# EAGLE schematic BSPD (EAGLE 9.3.0)
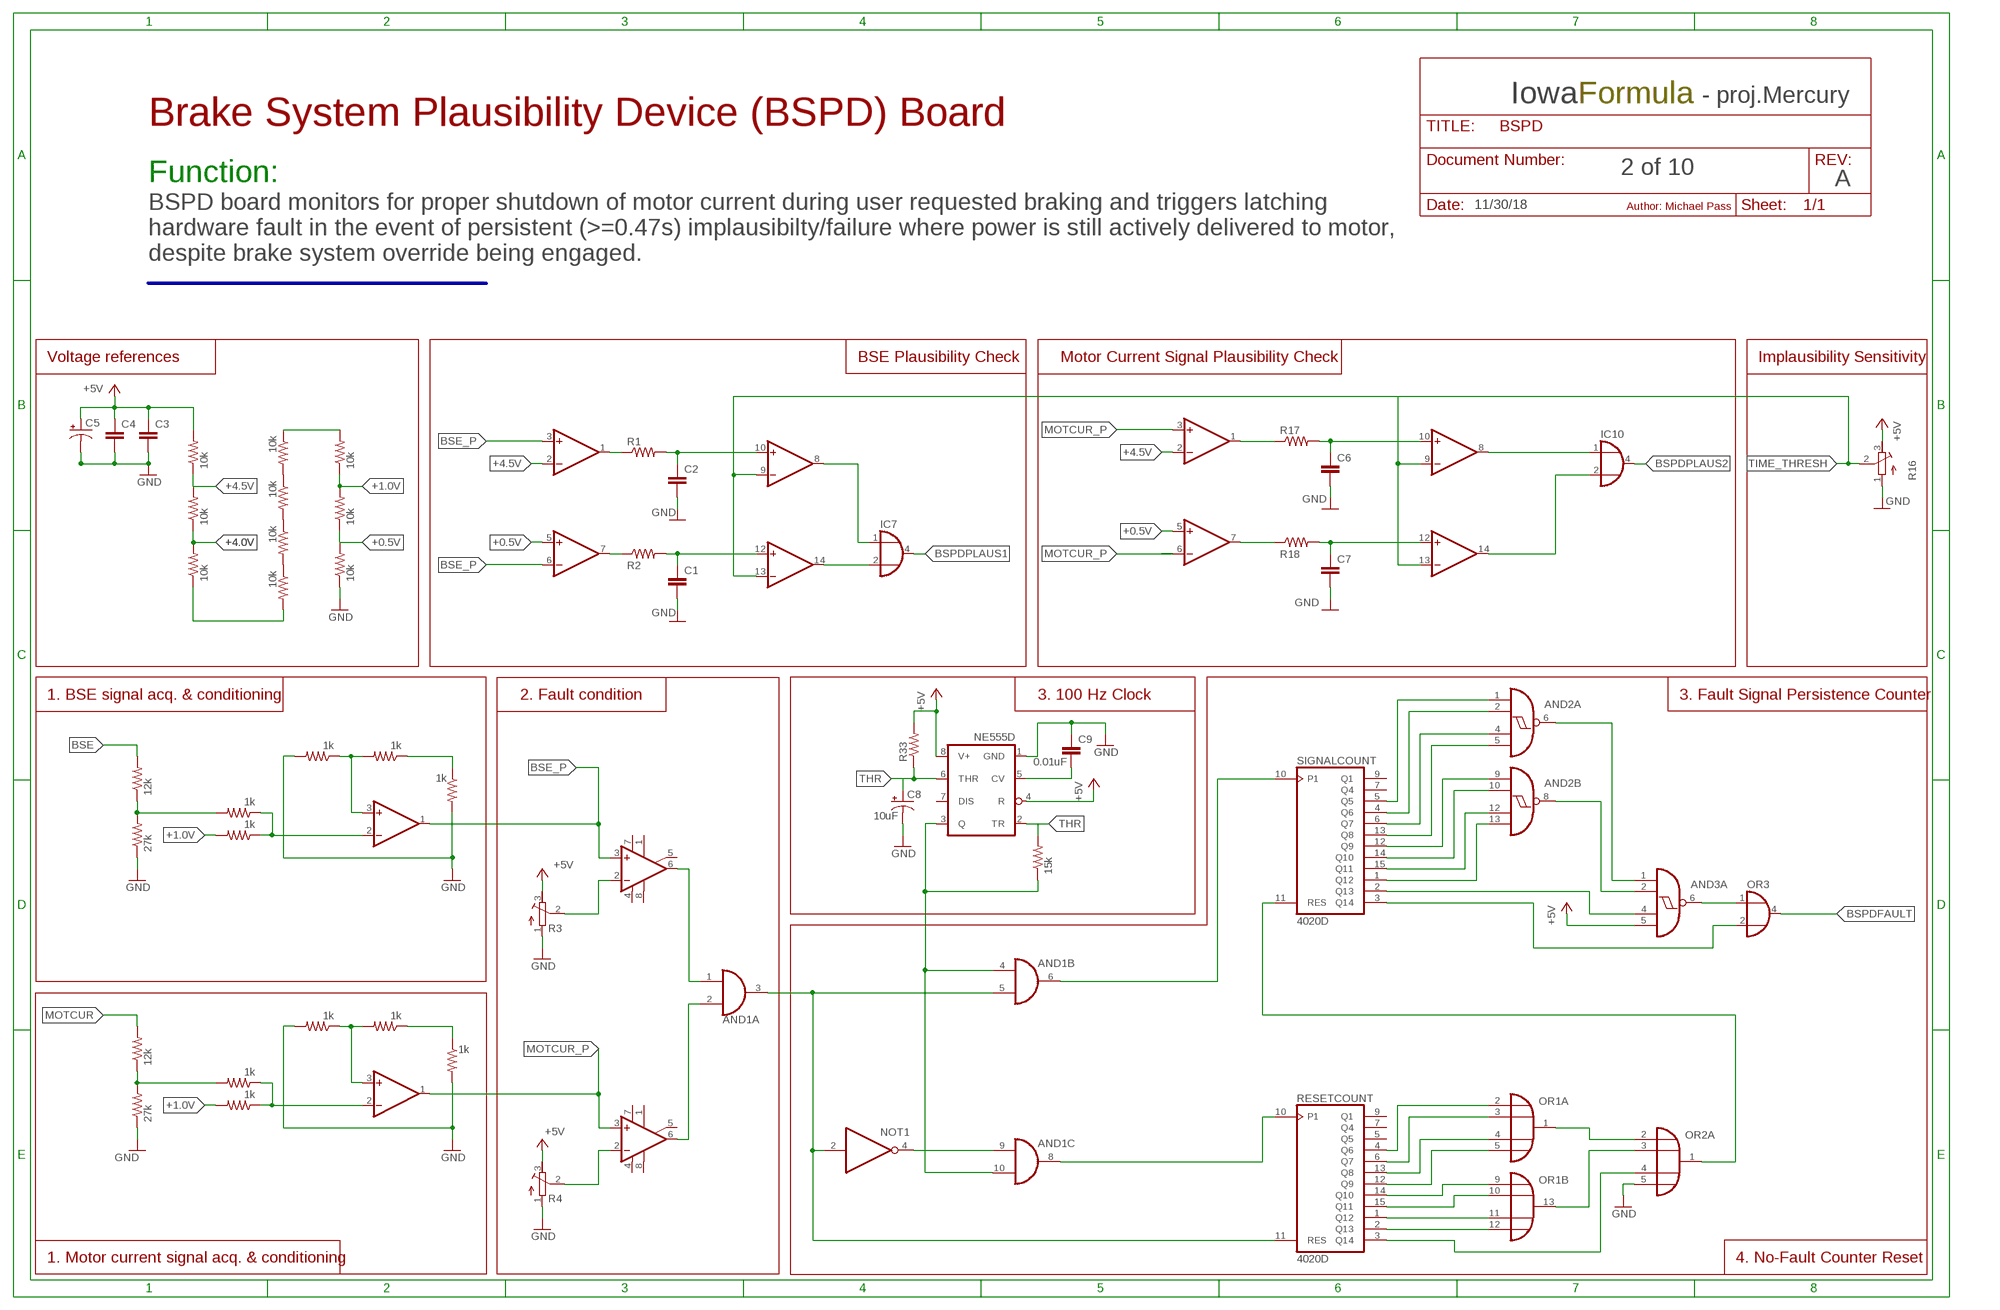
[diagram p0: schematic, sheet 1]

## Parts
AND1  74ALS09D  [SO14]
AND2  74HC13D  [SO14]
AND3  74HC13D  [SO14]
C1  C-EUC0805  [C0805]
C2  C-EUC0805  [C0805]
C3  C-EUC0805  [C0805]
C4  C-EUC0805  [C0805]
C5  CPOL-US085CS-1AR  [085CS_1AR]
C6  C-EUC0805  [C0805]
C7  C-EUC0805  [C0805]
C8  10uF  CPOL-US085CS-1AW  [085CS_1AW]
C9  0.01uF  C-EUC0805  [C0805]
IC1  LM741D  [SO08]
IC2  LM741D  [SO08]
IC3  OP11D  [SO14]
IC4  OP11D  [SO14]
IC5  OP11D  [SO14]
IC6  OP11D  [SO14]
IC7  74AHC1G32DCK  [SC70-5]
IC9  NE555D  [SO08]
IC10  74AHC1G32DCK  [SC70-5]
NOT1  74AHC1G04DCK  [SC70-5]
OR1  4072D  [SO14]
OR2  4072D  [SO14]
OR3  74AHC1G32DCK  [SC70-5]
R1  R-US_R0805  [R0805]
R2  R-US_R0805  [R0805]
R3  R-TRIMM3224X  [RTRIM3224X]
R4  R-TRIMM3224X  [RTRIM3224X]
R5  10k  R-US_R0805  [R0805]
R6  10k  R-US_R0805  [R0805]
R7  15k  R-US_R0805  [R0805]
R8  10k  R-US_R0805  [R0805]
R9  10k  R-US_R0805  [R0805]
R10  10k  R-US_R0805  [R0805]
R11  10k  R-US_R0805  [R0805]
R12  10k  R-US_R0805  [R0805]
R13  10k  R-US_R0805  [R0805]
R14  10k  R-US_R0805  [R0805]
R15  10k  R-US_R0805  [R0805]
R16  R-TRIMM3224X  [RTRIM3224X]
R17  R-US_R0805  [R0805]
R18  R-US_R0805  [R0805]
R19  12k  R-US_R0805  [R0805]
R20  27k  R-US_R0805  [R0805]
R21  12k  R-US_R0805  [R0805]
R22  27k  R-US_R0805  [R0805]
R23  1k  R-US_R0805  [R0805]
R24  1k  R-US_R0805  [R0805]
R25  1k  R-US_R0805  [R0805]
R26  1k  R-US_R0805  [R0805]
R27  1k  R-US_R0805  [R0805]
R28  1k  R-US_R0805  [R0805]
R29  1k  R-US_R0805  [R0805]
R30  1k  R-US_R0805  [R0805]
R31  1k  R-US_R0805  [R0805]
R32  1k  R-US_R0805  [R0805]
R33  R-US_R0805  [R0805]
RESETCOUNT  4020D  [SO16]
SIGNALCOUNT  4020D  [SO16]

## Nets
+0.5V: IC3.5(B:+IN) IC5.5(B:+IN) R14.1 R15.2
+1.0V: R13.1 R14.2 R24.2 R29.2
+4.0V: R6.1 R8.2
+4.5V: IC3.2(A:-IN) IC5.2(A:-IN) R5.1 R6.2
+5V: AND3.5(A:I3) C3.1 C4.1 C5.+ IC9.4(R) IC9.8(V+) R3.3(E) R4.3(E) R5.2 R16.3(E) R33.2
BSE: R19.2
BSE_P: IC1.3(+IN) IC3.3(A:+IN) IC3.6(B:-IN) IC4.1(A:OUT)
BSPDFAULT: OR3.4(O)
BSPDPLAUS1: IC7.4(O)
BSPDPLAUS2: IC10.4(O)
GND: C1.2 C2.2 C3.2 C4.2 C5.- C6.2 C7.2 C8.- C9.1 IC9.1(GND) OR2.5(A:I3) R3.1(A) R4.1(A) R15.1 R16.1(A) R20.1 R22.1 R25.2 R27.2 R30.2 R32.2
MOTCUR: R21.2
MOTCUR_P: IC2.3(+IN) IC5.3(A:+IN) IC5.6(B:-IN) IC6.1(A:OUT)
N$1: IC3.1(A:OUT) R1.1
N$2: R8.1 R9.2
N$3: IC4.3(A:+IN) R25.1 R26.2
N$4: R9.1 R10.2
N$5: R11.1 R12.2
N$6: IC5.1(A:OUT) R17.1
N$7: R12.1 R13.2
N$8: IC3.7(B:OUT) R2.1
N$9: R10.1 R11.2
N$10: C2.1 IC3.10(C:+IN) R1.2
N$11: C1.1 IC3.12(D:+IN) R2.2
N$12: C6.1 IC5.10(C:+IN) R17.2
N$13: C7.1 IC5.12(D:+IN) R18.2
N$14: IC5.7(B:OUT) R18.1
N$15: IC6.3(A:+IN) R30.1 R31.2
N$16: R21.1 R22.2 R28.2
N$17: R31.1 R32.1
N$18: IC6.2(A:-IN) R28.1 R29.1
N$19: IC1.2(-IN) R3.2(S)
N$20: R19.1 R20.2 R23.2
N$21: IC2.2(-IN) R4.2(S)
N$22: AND1.4(B:I0) AND1.10(C:I1) IC9.3(Q) R7.1
N$23: R26.1 R27.1
N$24: IC4.2(A:-IN) R23.1 R24.1
N$25: C9.2 IC9.5(CV)
N$26: AND1.2(A:I1) IC2.6(OUT)
N$27: AND1.1(A:I0) IC1.6(OUT)
N$28: AND1.3(A:O) AND1.5(B:I1) NOT1.2(I) RESETCOUNT.11(RES)
N$29: AND1.9(C:I0) NOT1.4(O)
N$30: AND1.8(C:O) RESETCOUNT.10(P1)
N$31: OR1.2(A:I0) RESETCOUNT.4(Q6)
N$32: OR1.3(A:I1) RESETCOUNT.6(Q7)
N$33: OR1.4(A:I2) RESETCOUNT.13(Q8)
N$34: OR1.5(A:I3) RESETCOUNT.12(Q9)
N$35: OR1.9(B:I0) RESETCOUNT.14(Q10)
N$36: OR1.10(B:I1) RESETCOUNT.15(Q11)
N$37: OR1.11(B:I2) RESETCOUNT.1(Q12)
N$38: OR1.12(B:I3) RESETCOUNT.2(Q13)
N$39: OR1.1(A:O) OR2.2(A:I0)
N$40: OR1.13(B:O) OR2.3(A:I1)
N$41: OR2.4(A:I2) RESETCOUNT.3(Q14)
N$42: OR2.1(A:O) SIGNALCOUNT.11(RES)
N$43: AND1.6(B:O) SIGNALCOUNT.10(P1)
N$44: IC3.8(C:OUT) IC7.1(I0)
N$45: IC3.14(D:OUT) IC7.2(I1)
N$46: IC5.8(C:OUT) IC10.1(I0)
N$47: IC5.14(D:OUT) IC10.2(I1)
N$48: AND2.6(A:O) AND3.1(A:I0)
N$49: AND2.8(B:O) AND3.2(A:I1)
N$50: AND2.13(B:I3) SIGNALCOUNT.1(Q12)
N$51: AND2.12(B:I2) SIGNALCOUNT.15(Q11)
N$52: AND2.10(B:I1) SIGNALCOUNT.14(Q10)
N$53: AND2.9(B:I0) SIGNALCOUNT.12(Q9)
N$54: AND2.5(A:I3) SIGNALCOUNT.13(Q8)
N$55: AND2.4(A:I2) SIGNALCOUNT.6(Q7)
N$56: AND2.2(A:I1) SIGNALCOUNT.4(Q6)
N$57: AND2.1(A:I0) SIGNALCOUNT.5(Q5)
N$58: AND3.4(A:I2) SIGNALCOUNT.2(Q13)
N$59: OR3.2(I1) SIGNALCOUNT.3(Q14)
N$60: AND3.6(A:O) OR3.1(I0)
THR: C8.+ IC9.2(TR) IC9.6(THR) R7.2 R33.1
TIME_THRESH: IC3.9(C:-IN) IC3.13(D:-IN) IC5.9(C:-IN) IC5.13(D:-IN) R16.2(S)
Unconnected: AND1.11(D:O) AND1.12(D:I0) AND1.13(D:I1) AND3.8(B:O) AND3.9(B:I0) AND3.10(B:I1) AND3.12(B:I2) AND3.13(B:I3) IC1.1(ON1) IC1.5(ON2) IC1.8(OPT) IC2.1(ON1) IC2.5(ON2) IC2.8(OPT) IC4.5(B:+IN) IC4.6(B:-IN) IC4.7(B:OUT) IC4.8(C:OUT) IC4.9(C:-IN) IC4.10(C:+IN) IC4.12(D:+IN) IC4.13(D:-IN) IC4.14(D:OUT) IC6.5(B:+IN) IC6.6(B:-IN) IC6.7(B:OUT) IC6.8(C:OUT) IC6.9(C:-IN) IC6.10(C:+IN) IC6.12(D:+IN) IC6.13(D:-IN) IC6.14(D:OUT) IC9.7(DIS) OR2.9(B:I0) OR2.10(B:I1) OR2.11(B:I2) OR2.12(B:I3) OR2.13(B:O) RESETCOUNT.5(Q5) RESETCOUNT.7(Q4) RESETCOUNT.9(Q1) SIGNALCOUNT.7(Q4) SIGNALCOUNT.9(Q1)

## Buses
B$1

## Notes on the sheet
- Iowa | Formula | - proj.Mercury
- Brake System Plausibility Device (BSPD) Board
- 2 of 10
- Function: | A
- 11/30/18 | Author: Michael Pass
- BSPD board monitors for proper shutdown of motor current during user requested braking and triggers latching
  hardware fault in the event of persistent (>=0.47s) implausibilty/failure where power is still actively delivered to motor,
  despite brake system override being engaged.
- Voltage references | BSE Plausibility Check | Motor Current Signal Plausibility Check | Implausibility Sensitivity
- 1. BSE signal acq. & conditioning | 2. Fault condition | 3. 100 Hz Clock | 3. Fault Signal Persistence Counter
- 4. No-Fault Counter Reset
- 1. Motor current signal acq. & conditioning

## Power pins joined to a net without a drawn wire
GND: AND1.7(P:GND) AND2.7(P:GND) AND3.7(P:GND) IC7.3(GND) IC10.3(GND) NOT1.3(GND) OR3.3(GND)
V+: IC1.7(V+) IC2.7(V+) IC3.4(P:V+) IC4.4(P:V+) IC5.4(P:V+) IC6.4(P:V+)
V-: IC1.4(V-) IC2.4(V-) IC3.11(P:V-) IC4.11(P:V-) IC5.11(P:V-) IC6.11(P:V-)
VCC: AND1.14(P:VCC) AND2.14(P:VCC) AND3.14(P:VCC) IC7.5(VCC) IC10.5(VCC) NOT1.5(VCC) OR3.5(VCC)
VDD: OR1.14(P:VDD) OR2.14(P:VDD) RESETCOUNT.16(VDD) SIGNALCOUNT.16(VDD)
VSS: OR1.7(P:VSS) OR2.7(P:VSS) RESETCOUNT.8(VSS) SIGNALCOUNT.8(VSS)

## Library data of the parts
AND1 = 74xx-eu:74*09: Quad 2-input AND gate, open collector
AND2 AND3 = 74xx-eu:74*13: Dual 4-input NAND schmitt trigger
C1-C4 C6 C7 C9 = rcl:C-EU: CAPACITOR, European symbol; SPICEPREFIX: C
C5 C8 = rcl:CPOL-US: POLARIZED CAPACITOR, American symbol; SPICEPREFIX: C
IC1 IC2 = linear:*741: OP AMP
IC3-IC6 = linear:OP11: Quad Low-Offset Low-Power OP AMP The OP-11 is pin compatible with the OP-400 , LM148, HA4741, RM4156, and LT1014 operational amplifiers source http://products.analog.com/products/info.asp?product=OP400
IC7 IC10 OR3 = 74xx-little-de:74*1G32: 2-input OR gate
IC9 = linear:*555: TIMER
NOT1 = 74xx-little-us:74*1G04: INVERTER Gate
OR1 OR2 = 40xx:4072: Dual 4-input OR
R1 R2 R5-R15 R17-R33 = rcl:R-US_: RESISTOR, American symbol; SPICEPREFIX: R
R3 R4 R16 = rcl:R-TRIMM: Trimm resistor; SPICEMODEL: X; SPICEPREFIXL: POT
RESETCOUNT SIGNALCOUNT = 40xx:4020: 14-stage binary/ripple COUNTER